# EAGLE design beeper (EAGLE 9.6.2)
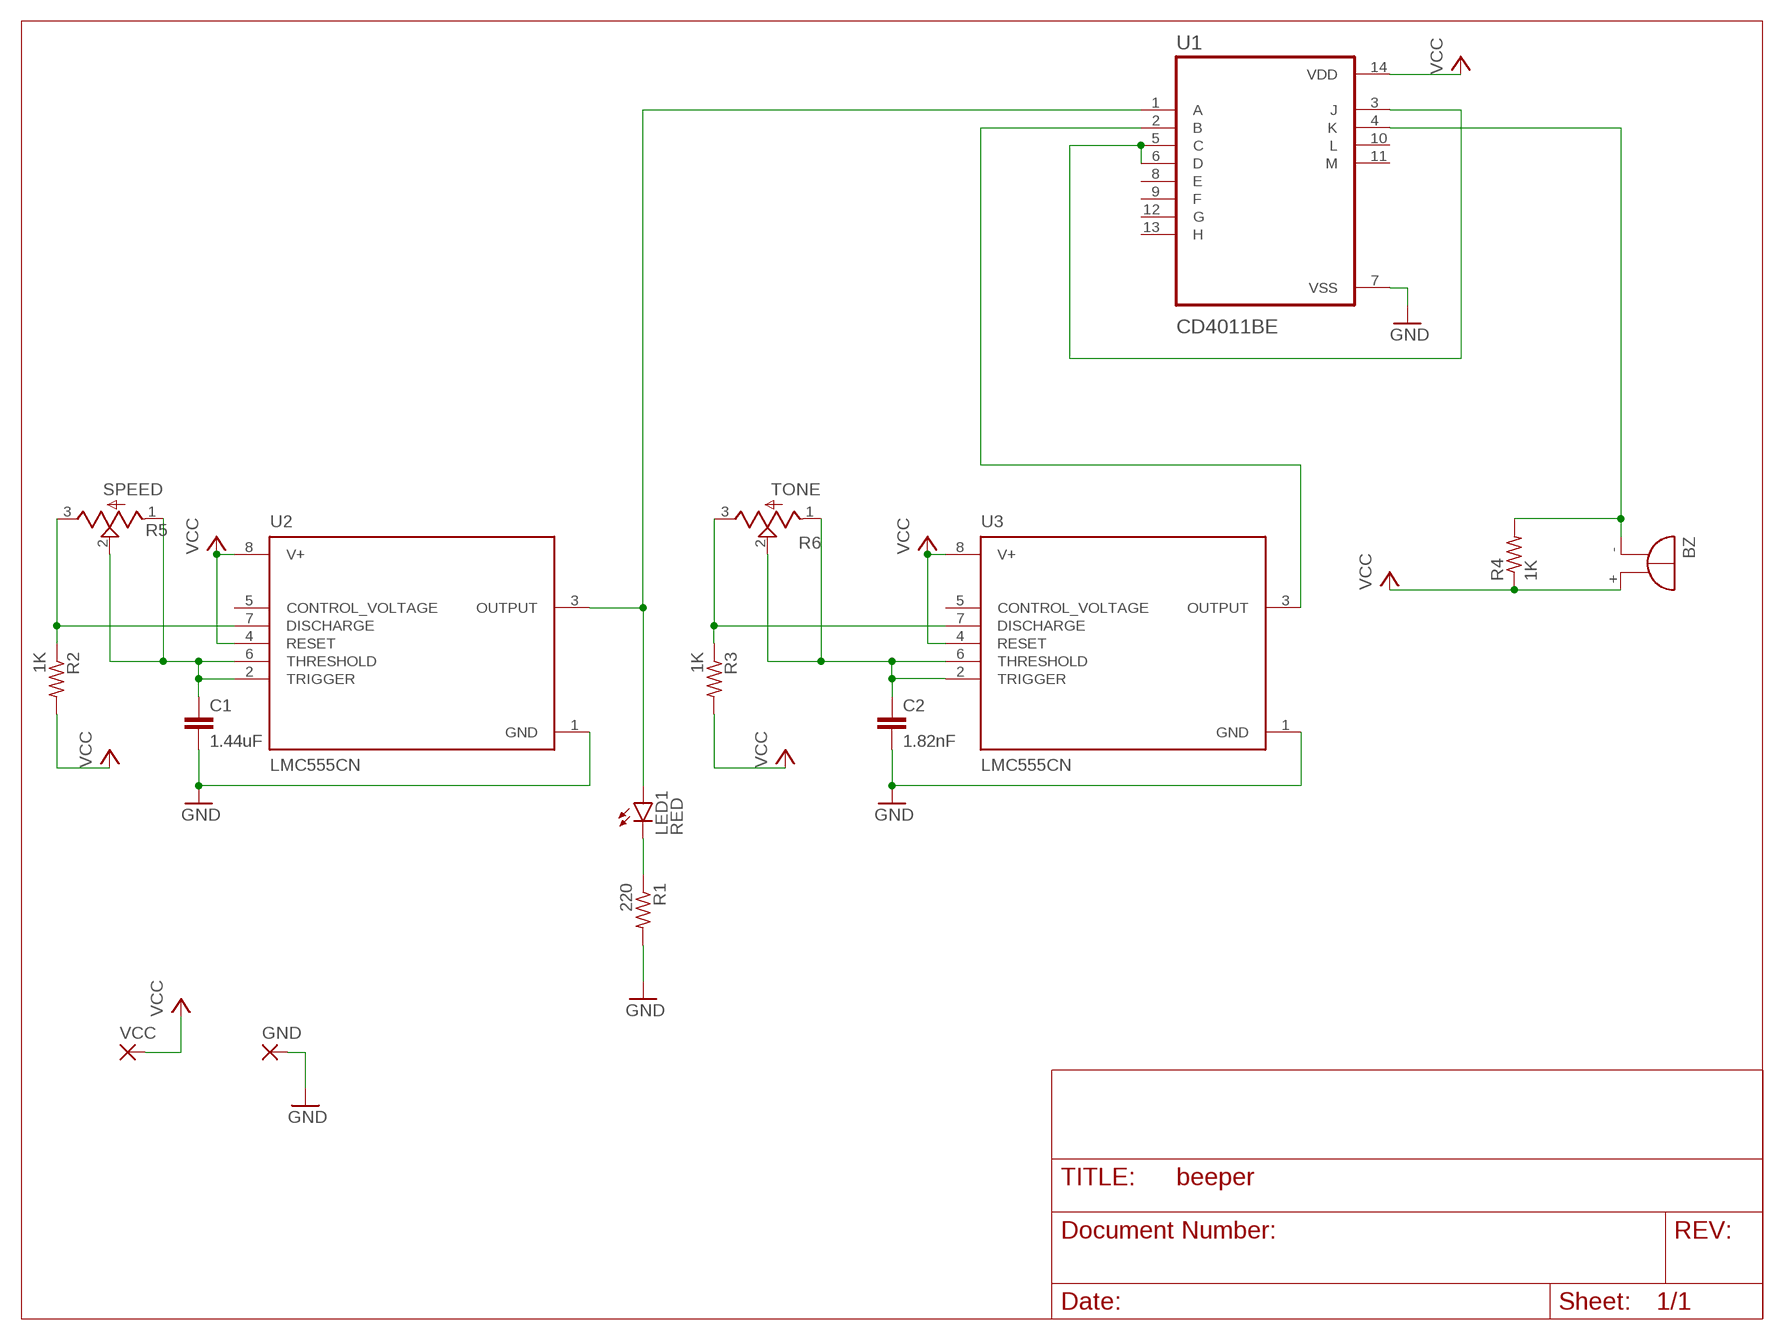
[diagram p0: schematic, sheet 1]

## Parts
BZ  F/QMBIII  [F/QMBIII]
C1  1.44uF  C2,5-3  [C2.5-3]
C2  1.82nF  C2,5-3  [C2.5-3]
GND  SMD2  [SMD1,27-2,54]
LED1  RED  TLLR4400  [LED3MM]
R1  220  R-US_0204/7  [0204/7]
R2  1K  R-US_0204/7  [0204/7]
R3  1K  R-US_0204/7  [0204/7]
R4  1K  R-US_0204/7  [0204/7]
R5  SPEED  PV12P105A01B00  [TO250P760H635-3_PV12P105A01B00]
R6  TONE  PV12P105A01B00  [TO250P760H635-3_PV12P105A01B00]
U1  CD4011BE  [DIP794W45P254L1969H508Q14]
U2  LMC555CN  [DIP794W45P254L959H508Q8]
U3  LMC555CN  [DIP794W45P254L959H508Q8]
VCC  SMD2  [SMD1,27-2,54]

## Nets
GND: C1.2 C2.2 GND.1(P) R1.2 U1.7(VSS) U2.1(GND) U3.1(GND)
N$1: R2.1 R5.3 U2.7(DISCHARGE)
N$2: C1.1 R5.1 R5.2 U2.2(TRIGGER) U2.6(THRESHOLD)
N$3: LED1.A U1.1(A) U2.3(OUTPUT)
N$4: LED1.K(C) R1.1
N$5: R3.1 R6.3 U3.7(DISCHARGE)
N$6: C2.1 R6.1 R6.2 U3.2(TRIGGER) U3.6(THRESHOLD)
N$8: U1.2(B) U3.3(OUTPUT)
N$9: U1.3(J) U1.5(C) U1.6(D)
N$10: BZ.-(+) R4.2 U1.4(K)
VCC: BZ.+(-) R2.2 R3.2 R4.1 U1.14(VDD) U2.4(RESET) U2.8(V+) U3.4(RESET) U3.8(V+) VCC.1(P)
Unconnected: U1.8(E) U1.9(F) U1.10(L) U1.11(M) U1.12(G) U1.13(H) U2.5(CONTROL_VOLTAGE) U3.5(CONTROL_VOLTAGE)

## Library data of the parts
BZ = buzzer:F/QMBIII: BUZZER Source: Buerklin; MF: PROJECTS UNLIMITED; MPN: AI-1440-TWT-12V-R; OC_FARNELL: unknown; OC_NEWARK: 47W0784
C1 = capacitor-wima:C: CAPACITOR naming: grid - package width; MF: MULTICOMP PRO; MPN: MPMPP250W15J0N200; OC_NEWARK: 21AH3407
C2 = capacitor-wima:C: CAPACITOR naming: grid - package width; MF: TDK; MPN: FA26C0G2J182JNU00; OC_NEWARK: 24AJ0369
GND VCC = wirepad:SMD2: SMD PAD; OC_NEWARK: unknown
LED1 = led:TLLR4400: Low Current (2mA) LED 3 mm Tinted Diffused Package color RED Source: Data sheet <http://www.farnell.com/datasheets/391100.pdf>; MF: VISHAY; MPN: TLLR4400; OC_FARNELL: 1612437; OC_NEWARK: 33C1369
R1 = rcl:R-US_: RESISTOR, American symbol; MF: MULTICOMP PRO; MPN: MCF 0.25W 220R; OC_NEWARK: 38K0351; SPICEPREFIX: R
R2-R4 = rcl:R-US_: RESISTOR, American symbol; MF: MULTICOMP PRO; MPN: MP006904; OC_NEWARK: 25AJ2358; SPICEPREFIX: R
R5 R6 = PV12P105A01B00:PV12P105A01B00: TRIMMER 100K OHM 0.5W TH Check availability <https://pricing.snapeda.com/parts/PV12P105A01B00/Murata%20Electronics/view-part?ref=eda>; AVAILABILITY: Not in stock; DESCRIPTION: TRIMMER 1M OHM 0.5W PC PIN TOP; MF: BOURNS; MP: PV12P105A01B00; MPN: PV12P105A01B00; OC_NEWARK: 13AC5460; PACKAGE: None; PRICE: None
U1 = CD4011BE:CD4011BE: Check availability <https://pricing.snapeda.com/parts/CD4011BE/Texas%20Instruments/view-part?ref=eda>; AVAILABILITY: In Stock; DESCRIPTION: 4-ch, 2-input, 3-V to 18-V NAND gates; MF: TEXAS INSTRUMENTS; MP: CD4011BE; MPN: CD4011BE; OC_NEWARK: 28AH2021; PACKAGE: PDIP-14 Texas Instruments; PRICE: None; PURCHASE-URL: https://pricing.snapeda.com/search/part/CD4011BE/?ref=eda
U2 U3 = LMC555CN:LMC555CN: Check availability <https://pricing.snapeda.com/parts/LMC555CN/Texas%20Instruments/view-part?ref=eda>; AVAILABILITY: In Stock; DESCRIPTION: 555 Type, Timer/Oscillator (Single) IC 3MHz 8-PDIP; MF: ONSEMI; MP: LMC555CN; MPN: LM555CN; OC_NEWARK: 58K8943; PACKAGE: PDIP-8 Texas; PRICE: None; PURCHASE-URL: https://pricing.snapeda.com/search/part/LMC555CN/?ref=eda

## Net classes
0 default: width 0.305 mm, drill 0.508 mm, clearance 0.254 mm

## Board
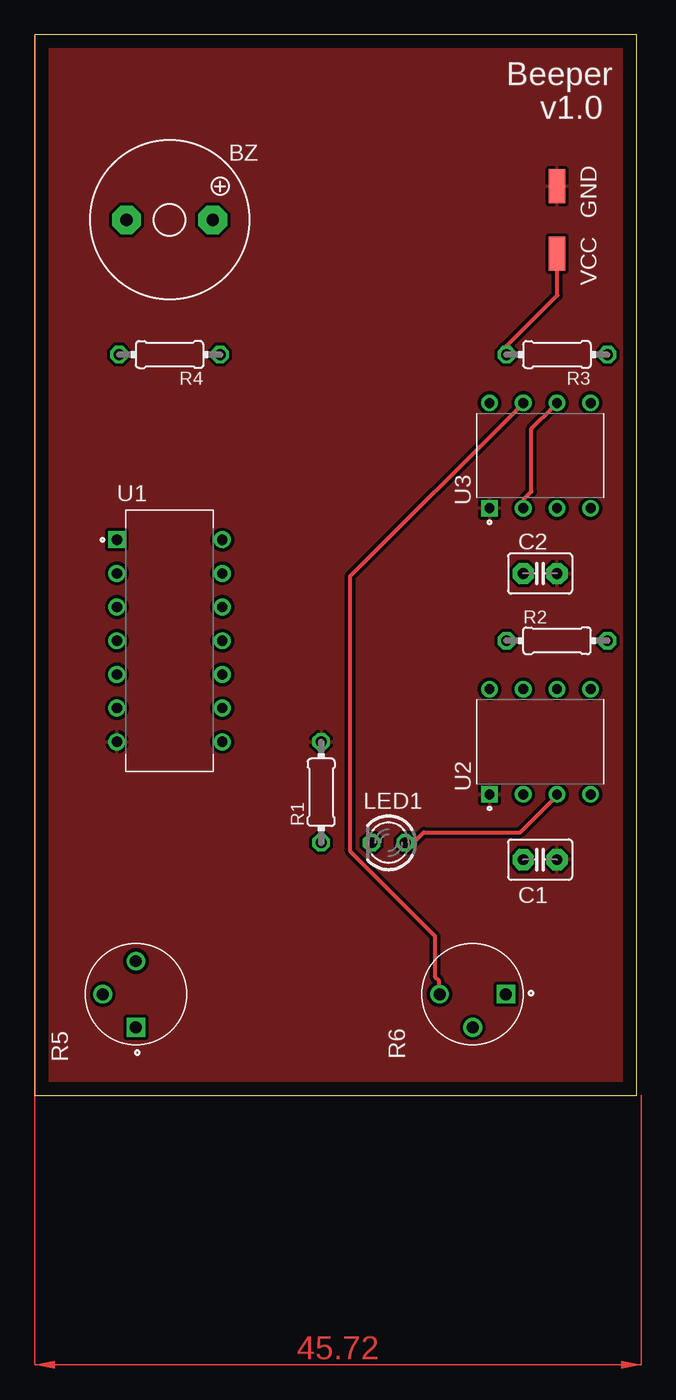
[diagram p1: board, top side]
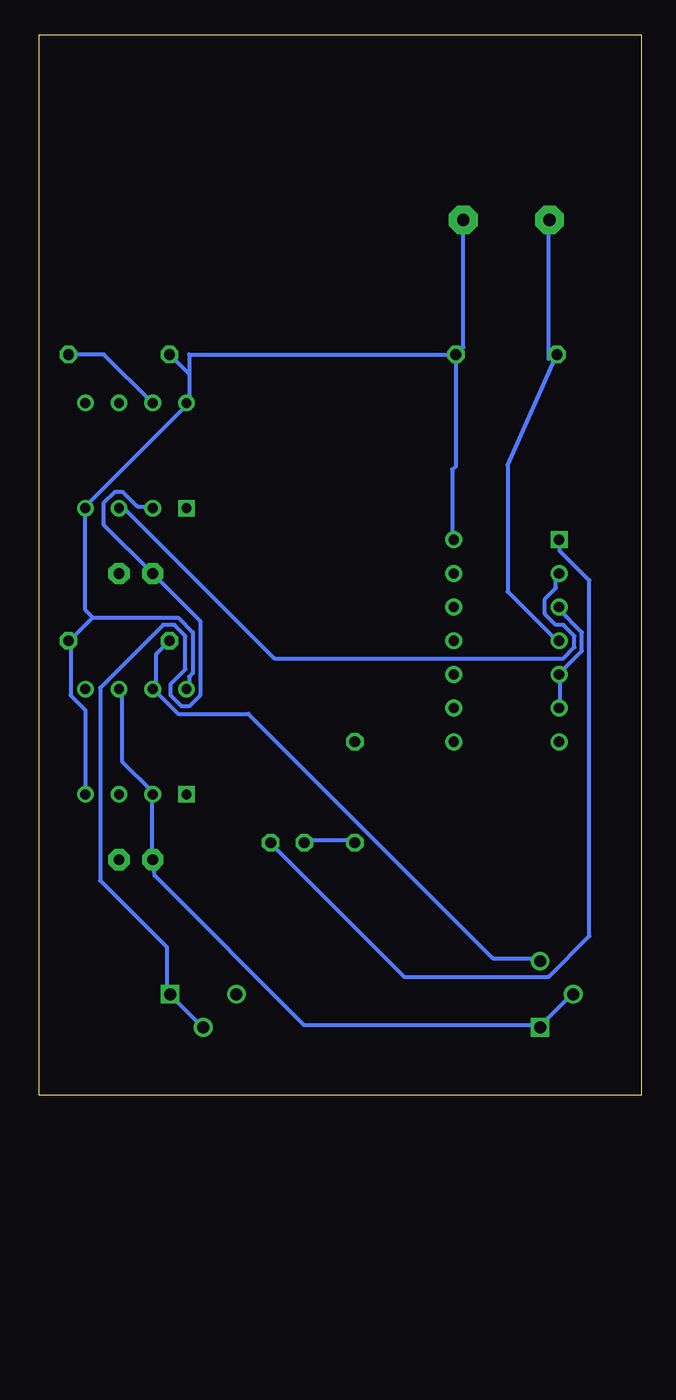
[diagram p2: board, bottom side, seen from below]

Size 45.39 x 80 mm. Coordinates in mm from the lower left corner, seen from the top.
Outline: 0,0 45.39,0 45.39,80 0,80 0,0
Copper layers (1*16): Top 0.035mm / dielectric 1.5mm / Bottom 0.035mm
Design rules "default": minimum track width 6mil, minimum drill 0.35mm, track to track 6mil, track to pad 6mil, pad to pad 6mil, via to via 6mil, smd to smd 6mil, copper to edge 40mil, drill to drill 6mil, minimum pad ring 10mil, minimum via ring 8mil, stop-mask expansion 4mil, vias tented up to drill 0mil, thermal gap 10mil

### Footprints (pad centres in the part's own frame; a part is rotated, then mirrored left to right if it is on the bottom)
F/QMBIII = drill 0.914 pad 2.159 octagon: + 3.251,0; - -3.251,0
C2.5-3 = drill 0.813 pad 1.6 octagon: 1 -1.27,0; 2 1.27,0
SMD1,27-2,54 = smd 1.27 x 2.54: 1 0,0
LED3MM = drill 0.813 octagon: A -1.27,0; K 1.27,0
0204/7 = drill 0.813 octagon: 1 -3.81,0; 2 3.81,0
TO250P760H635-3_PV12P105A01B00 = drill 0.9 square: 1 -2.5,0 | drill 0.9: 2 0,2.5; 3 2.5,0
DIP794W45P254L1969H508Q14 = drill 0.77 pad 1.17 square: 1 -3.97,7.62 | drill 0.77 pad 1.17: 2 -3.97,5.08; 3 -3.97,2.54; 4 -3.97,0; 5 -3.97,-2.54; 6 -3.97,-5.08; 7 -3.97,-7.62; 8 3.97,-7.62; 9 3.97,-5.08; 10 3.97,-2.54; 11 3.97,0; 12 3.97,2.54; 13 3.97,5.08; 14 3.97,7.62
DIP794W45P254L959H508Q8 = drill 0.74 pad 1.13 square: 1 -3.97,3.81 | drill 0.74 pad 1.13: 2 -3.97,1.27; 3 -3.97,-1.27; 4 -3.97,-3.81; 5 3.97,-3.81; 6 3.97,-1.27; 7 3.97,1.27; 8 3.97,3.81

### Placement (x,y rotation side)
BZ  10.16,66.04 0 top
C1  38.1,17.78 0 top
C2  38.1,39.37 0 top
GND  39.37,68.58 0 top
LED1  26.67,19.05 180 top
R1  21.59,22.86 90 top
R2  39.37,34.29 0 top
R3  39.37,55.88 180 top
R4  10.16,55.88 180 top
R5  7.62,7.62 90 top
R6  33.02,7.62 180 top
U1  10.16,34.29 0 top
U2  38.1,26.67 90 top
U3  38.1,48.26 90 top
VCC  39.37,63.5 0 top

### Tracks (layer width: path | path; a pad name or v marks a point on that pad's centre or on a via)
GND
  pour Top: -1.27,81.28 -1.27,-1.27 46.99,-1.27 46.99,81.28
N$1
  Bottom 0.305: R2.1 36.6,33.25 36.6,30.73 U2.7 36.6,30.45 34.92,28.78 29.62,28.78 11.18,10.34 7.82,10.34 R5.3
N$2
  Bottom 0.305: R5.2 5.31,7.54 7.54,5.31 R5.1 7.82,5.31 25.43,5.31 36.7,16.58 C1.1 36.88,18.03 36.88,22.63 U2.2 36.88,22.91 39.12,25.15 39.12,30.45 U2.6
N$3
  Top 0.305: U2.3 39.12,22.63 39.12,22.35 36.6,19.84 29.34,19.84 28.5,19 27.94,19 LED1.A
  Bottom 0.305: U1.1 6.15,41.91 6.15,41.07 3.91,38.84 3.91,12.01 6.99,8.94 17.88,8.94 27.94,19 LED1.A
N$4
  Bottom 0.305: R1.1 21.79,19.28 25.15,19.28 LED1.K
N$5
  Top 0.305: R6.3 30.45,7.82 30.45,8.66 30.18,8.94 30.18,12.01 23.75,18.44 23.75,39.12 36.6,51.97 U3.7
  Bottom 0.305: R3.1 40.51,55.88 36.88,52.25 U3.7
N$6
  Top 0.305: U3.6 39.12,51.97 37.44,50.29 37.44,45.54 36.88,44.98 36.88,44.42 U3.2
  Bottom 0.305: R6.2 33.25,5.31 35.48,7.54 R6.1 35.76,7.82 35.76,11.18 40.79,16.2 40.79,30.73 36.04,35.48 35.2,35.48 34.37,34.65 34.37,32.13 35.48,31.01 35.48,30.18 34.65,29.34 34.09,29.34 33.25,30.18 33.25,35.76 36.6,39.12 C2.1 36.88,39.4 40.51,43.03 40.51,44.7 39.67,45.54 39.12,45.54 38,44.42 36.88,44.42 U3.2
N$8
  Bottom 0.305: U1.2 6.43,39.12 6.43,38.28 7.26,37.44 7.26,36.32 6.43,35.48 5.87,35.48 5.03,34.65 5.03,33.81 5.87,32.97 27.66,32.97 39.12,44.42 U3.3
N$9
  Bottom 0.305: U1.6 6.15,29.34 6.15,31.57 U1.5 6.15,31.85 4.47,33.53 4.47,34.92 6.15,36.6 U1.3
N$10
  Bottom 0.305: U1.4 6.43,34.37 10.06,38 10.06,47.54 R4.2 6.99,55.56 6.99,65.94 BZ.-
VCC
  Top 0.305: VCC.1 39.4,63.42 39.4,60.35 35.48,56.44 35.48,55.88 R3.2
  Bottom 0.305: U1.14 14.25,41.91 14.25,47.22 13.97,47.44 R4.1 | 34.09,54.41 34.09,55.88 R4.1 | 34.09,54.41 34.09,52.25 U3.8 34.37,51.97 41.91,44.42 U3.4 41.91,36.6 41.35,36.04 | 41.35,36.04 34.92,36.04 33.81,34.92 33.81,31.85 34.09,31.57 34.09,30.73 U2.8 | 41.35,36.04 43.03,34.37 R2.2 43.03,34.09 43.03,30.18 41.91,29.06 U2.4 | BZ.+ 13.41,56.44 R4.1 | R3.2 34.09,54.41
(copper drawn outside any net)
  shapes: Top area x2

### Text on the board
tPlace: Beeper | v1.0